# EAGLE schematic Drinks_MotorDriver-v0.1 (EAGLE 6.4)
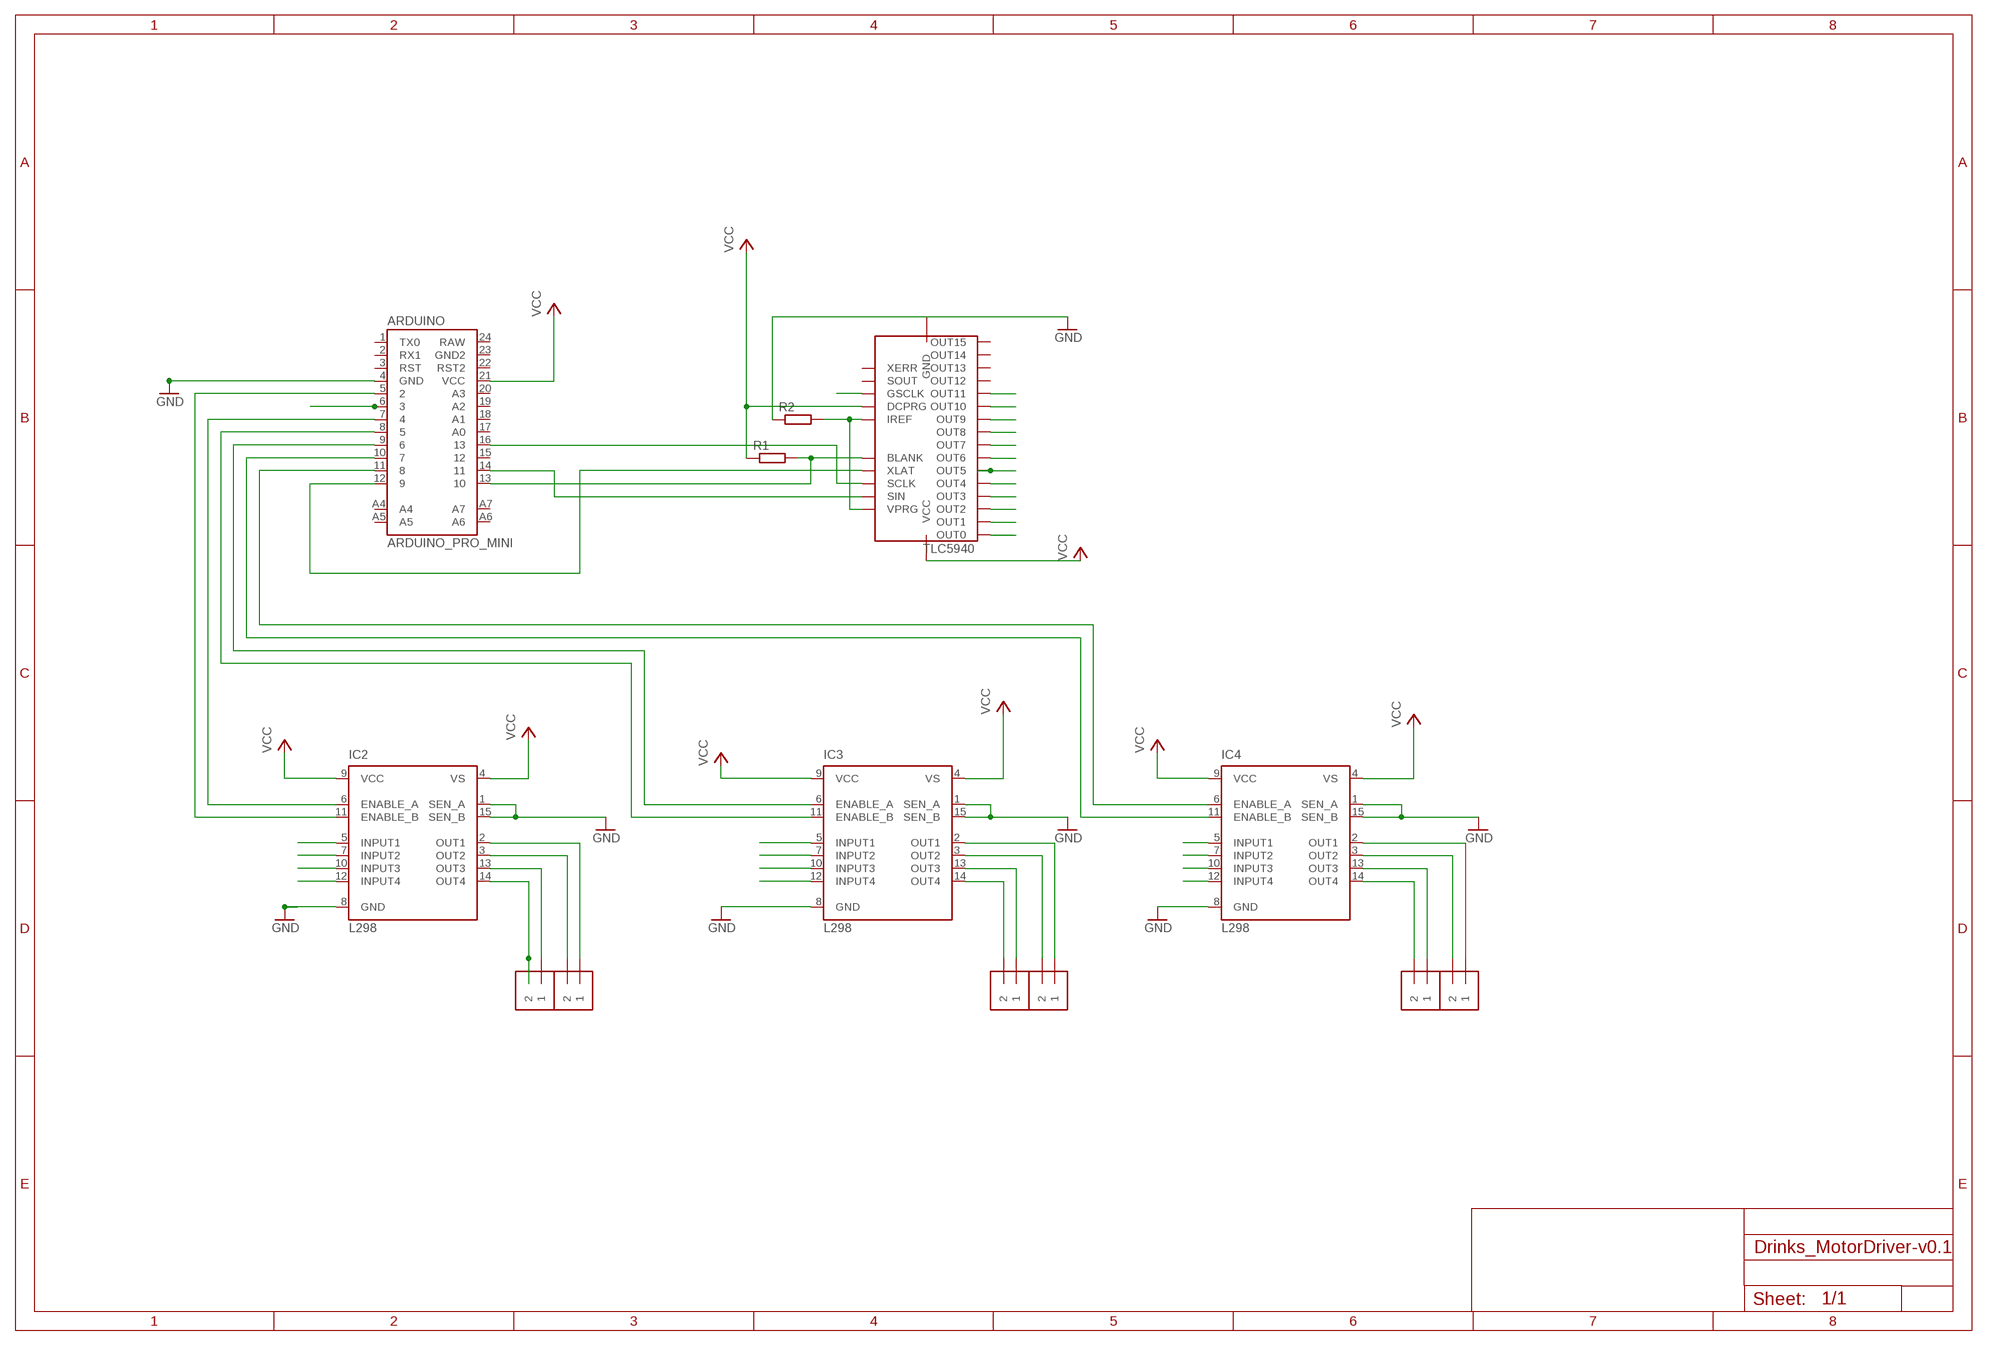
[diagram p0: schematic, sheet 1]

## Parts
ARDUINO  ARDUINO_PRO_MINI  [ARDUINO_PRO_MINI]
IC2  L298  [MULTIWATT-15]
IC3  L298  [MULTIWATT-15]
IC4  L298  [MULTIWATT-15]
J1  1X2-3.5MM  [1X2-3.5MM]
J2  1X2-3.5MM  [1X2-3.5MM]
J3  1X2-3.5MM  [1X2-3.5MM]
J4  1X2-3.5MM  [1X2-3.5MM]
J5  1X2-3.5MM  [1X2-3.5MM]
J6  1X2-3.5MM  [1X2-3.5MM]
R1  R-EU_0204/7  [0204/7]
R2  R-EU_0204/7  [0204/7]
TLC5940  IC-PACKAGE_DIL28-4  [IC-PACKAGE_DIL28-4]

## Nets
GND: ARDUINO.4(GND) IC2.1(SEN_A) IC2.8(GND) IC2.15(SEN_B) IC3.1(SEN_A) IC3.8(GND) IC3.15(SEN_B) IC4.1(SEN_A) IC4.8(GND) IC4.15(SEN_B) R2.1 TLC5940.22(GND)
GSCLK: ARDUINO.6 TLC5940.18(GSCLK)
MOT1A: IC2.5(INPUT1) TLC5940.28(OUT0)
MOT1B: IC2.7(INPUT2) TLC5940.1(OUT1)
MOT2A: IC2.10(INPUT3) TLC5940.2(OUT2)
MOT2B: IC2.12(INPUT4) TLC5940.3(OUT3)
MOT3A: IC3.5(INPUT1) TLC5940.4(OUT4)
MOT3B: IC3.7(INPUT2) TLC5940.5(OUT5)
MOT4A: IC3.10(INPUT3) TLC5940.6(OUT6)
MOT4B: IC3.12(INPUT4) TLC5940.7(OUT7)
MOT5A: IC4.5(INPUT1) TLC5940.8(OUT8)
MOT5B: IC4.7(INPUT2) TLC5940.9(OUT9)
MOT6A: IC4.10(INPUT3) TLC5940.10(OUT10)
MOT6B: IC4.12(INPUT4) TLC5940.11(OUT11)
N$1: ARDUINO.13 R1.2 TLC5940.23(BLANK)
N$2: R2.2 TLC5940.20(IREF) TLC5940.27(VPRG)
N$3: ARDUINO.5 IC2.11(ENABLE_B)
N$4: ARDUINO.14 TLC5940.26(SIN)
N$5: ARDUINO.7 IC2.6(ENABLE_A)
N$6: ARDUINO.12 TLC5940.24(XLAT)
N$7: ARDUINO.8 IC3.11(ENABLE_B)
N$8: ARDUINO.9 IC3.6(ENABLE_A)
N$9: ARDUINO.10 IC4.11(ENABLE_B)
N$10: ARDUINO.11 IC4.6(ENABLE_A)
N$11: IC2.14(OUT4) J1.2
N$12: IC2.13(OUT3) J1.1
N$13: IC2.3(OUT2) J2.2
N$14: IC2.2(OUT1) J2.1
N$15: IC3.14(OUT4) J3.2
N$16: IC3.13(OUT3) J3.1
N$17: IC3.3(OUT2) J4.2
N$18: IC3.2(OUT1) J4.1
N$19: IC4.14(OUT4) J5.2
N$20: IC4.13(OUT3) J5.1
N$21: IC4.3(OUT2) J6.2
N$22: IC4.2(OUT1) J6.1
SCLK: ARDUINO.16 TLC5940.25(SCLK)
VCC: ARDUINO.21(VCC) IC2.9(VCC) IC3.4(VS) IC3.9(VCC) IC4.9(VCC) R1.1 TLC5940.19(DCPRG) TLC5940.21(VCC)
VS: IC2.4(VS) IC4.4(VS) ; supply symbol labelled VCC
Unconnected: ARDUINO.1(TX0) ARDUINO.2(RX1) ARDUINO.3(RST) ARDUINO.15 ARDUINO.17(A0) ARDUINO.18(A1) ARDUINO.19(A2) ARDUINO.20(A3) ARDUINO.22(RST2) ARDUINO.23(GND2) ARDUINO.24(RAW) ARDUINO.A4 ARDUINO.A5 ARDUINO.A6 ARDUINO.A7 TLC5940.12(OUT12) TLC5940.13(OUT13) TLC5940.14(OUT14) TLC5940.15(OUT15) TLC5940.16(XERR) TLC5940.17(SOUT)

## Library data of the parts
ARDUINO = SparkFun-Boards:ARDUINO_PRO_MINI
IC2-IC4 = st-microelectronics:L298: DUAL FULL-BRIDGE DRIVER; MPN: L298N; OC_FARNELL: 1589425; OC_NEWARK: 32M1527
J1-J6 = adafruit:1X2: 3.5mm Terminal block http://www.ladyada.net/library/pcb/eaglelibrary.html
R1 R2 = resistor:R-EU_: RESISTOR, European symbol
TLC5940 = TLC5940:IC-PACKAGE_DIL28: Dual In Line